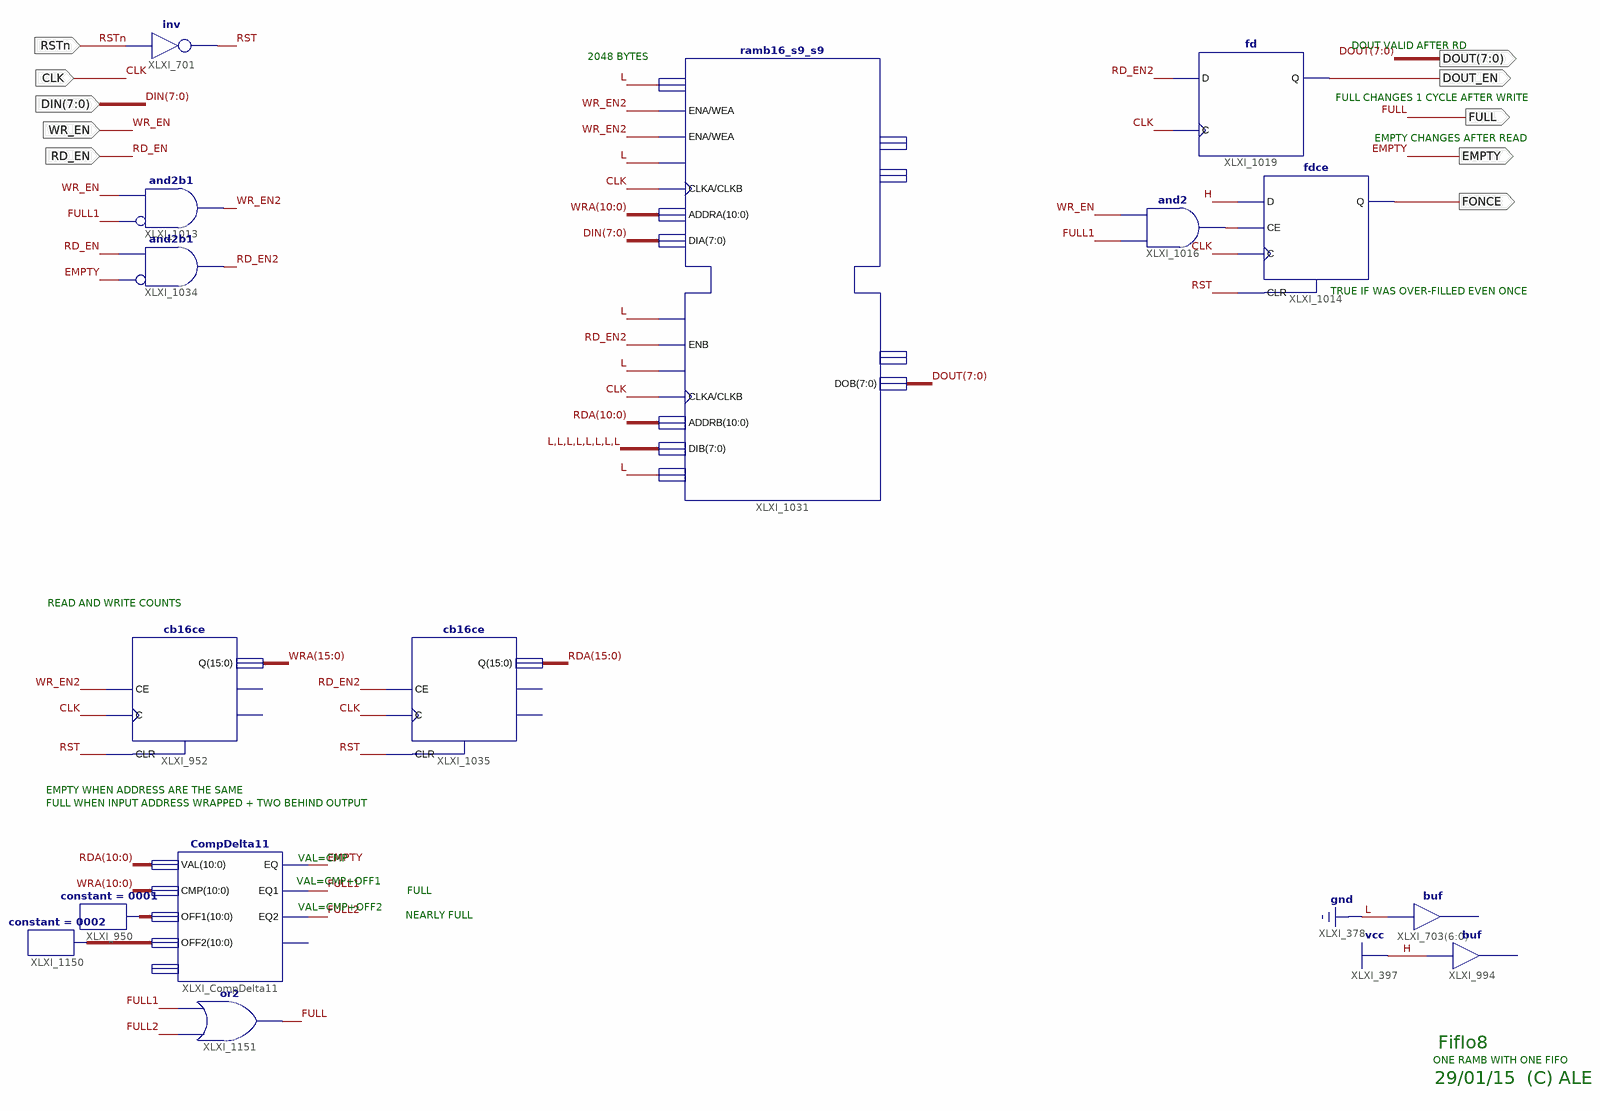
[diagram p0: schematic sheet 1]
// Xilinx ISE schematic FifoIo8.sch (zynq) as structural Verilog: 15 symbols, 10 ports
module FifoIo8 (
  input  CLK,
  input  RSTn,
  input  [7:0] DIN,
  input  WR_EN,
  input  RD_EN,
  output DOUT_EN,
  output FONCE,
  output EMPTY,
  output FULL,
  output [7:0] DOUT
);

  wire FULL1, FULL2, RD_EN2, RST, WR_EN2, XLXN_708;
  wire [10:0] XLXN_1161, XLXN_1162;
  wire [15:0] RDA, WRA;

  not XLXI_701 (RST, RSTn);
  and XLXI_1013 (WR_EN2, ~FULL1, WR_EN);  // and2b1
  and XLXI_1034 (RD_EN2, ~EMPTY, RD_EN);  // and2b1
  ramb16_s9_s9 XLXI_1031 (
    .ADDRA(WRA[10:0]), .ADDRB(RDA[10:0]), .CLKA(CLK), .CLKB(CLK), .DIA(DIN), .DIB({8{1'b0}}), .DIPA(1'b0),
    .DIPB(1'b0), .ENA(WR_EN2), .ENB(RD_EN2), .SSRA(1'b0), .SSRB(1'b0), .WEA(WR_EN2), .WEB(1'b0), .DOB(DOUT));  // open: DOA, DOPA, DOPB
  // buf XLXI_994 has open pins: I=1'b1, O=open
  // buf XLXI_703[6..0] has open pins: I=1'b0, O=open
  fd XLXI_1019 (.C(CLK), .D(RD_EN2), .Q(DOUT_EN));
  and XLXI_1016 (XLXN_708, FULL1, WR_EN);
  fdce XLXI_1014 (.C(CLK), .CE(XLXN_708), .CLR(RST), .D(1'b1), .Q(FONCE));
  cb16ce XLXI_952 (.C(CLK), .CE(WR_EN2), .CLR(RST), .Q(WRA));  // open: CEO, TC
  cb16ce XLXI_1035 (.C(CLK), .CE(RD_EN2), .CLR(RST), .Q(RDA));  // open: CEO, TC
  constant #(.CValue("0001")) XLXI_950 (.O(XLXN_1161));
  constant #(.CValue("0002")) XLXI_1150 (.O(XLXN_1162));
  or XLXI_1151 (FULL, FULL2, FULL1);
  CompDelta11 XLXI_CompDelta11 (
    .CMP(WRA[10:0]), .EQ(EMPTY), .EQ1(FULL1), .EQ2(FULL2), .OFF1(XLXN_1161), .OFF2(XLXN_1162), .VAL(RDA[10:0]));  // open: EQ3, OFF3

  // Notes on the sheet:
  //   DOUT VALID AFTER RD
  //   2048 BYTES
  //   FULL CHANGES 1 CYCLE AFTER WRITE
  //   EMPTY CHANGES AFTER READ
  //   TRUE IF WAS OVER-FILLED EVEN ONCE
  //   READ AND WRITE COUNTS
  //   EMPTY WHEN ADDRESS ARE THE SAME
  //   FULL WHEN INPUT ADDRESS WRAPPED + TWO BEHIND OUTPUT
  //   VAL=CMP
  //   VAL=CMP+OFF1
  //   FULL
  //   VAL=CMP+OFF2
  //   NEARLY FULL
  //   FifIo8
  //   ONE RAMB WITH ONE FIFO
  //   29/01/15  (C) ALE
endmodule
